# Altium project prjMotores.PrjPcb
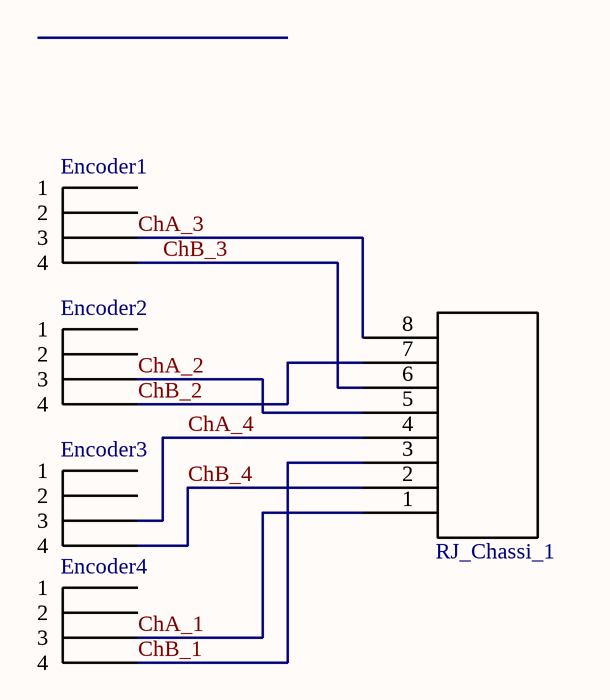
[diagram p0: schMotores.SchDoc]
1 sheet, 5 parts. Net scope: global (net labels, ports and power ports of the same name join across sheets).
Board file: pcbMotores.PcbDoc

## Sheet schMotores.SchDoc
size A4

### Parts
Encoder1  KK4  [4-vias]  (value not drawn)
Encoder2  KK4  [4-vias]  (value not drawn)
Encoder3  KK4  [4-vias]  (value not drawn)
Encoder4  KK4  [4-vias]  (value not drawn)
RJ_Chassi_1  RJ45  [RJ45_90]  (value not drawn)

### Nets
ChA_1: Encoder4.3 RJ_Chassi_1.1
ChA_2: Encoder2.3 RJ_Chassi_1.5
ChA_3: Encoder1.3 RJ_Chassi_1.8
ChA_4: Encoder3.3 RJ_Chassi_1.4
ChB_1: Encoder4.4 RJ_Chassi_1.3
ChB_2: Encoder2.4 RJ_Chassi_1.7
ChB_3: Encoder1.4 RJ_Chassi_1.6
ChB_4: Encoder3.4 RJ_Chassi_1.2

Not connected (* = marked no-connect by the designer): Encoder1 1 2; Encoder2 1 2; Encoder3 1 2; Encoder4 1 2

### Library data of the parts
Encoder1-Encoder4 = KK4Vias: ComponentLink1Description: Fabricante; ComponentLink1URL: https://www.molex.com/molex/products/family?key=kk_254_rpc_connector_system&channel=products&chanName=family&pageTitle=Introduction&parentKey=kk_interconnect_solutions
RJ_Chassi_1 = RJ45_90